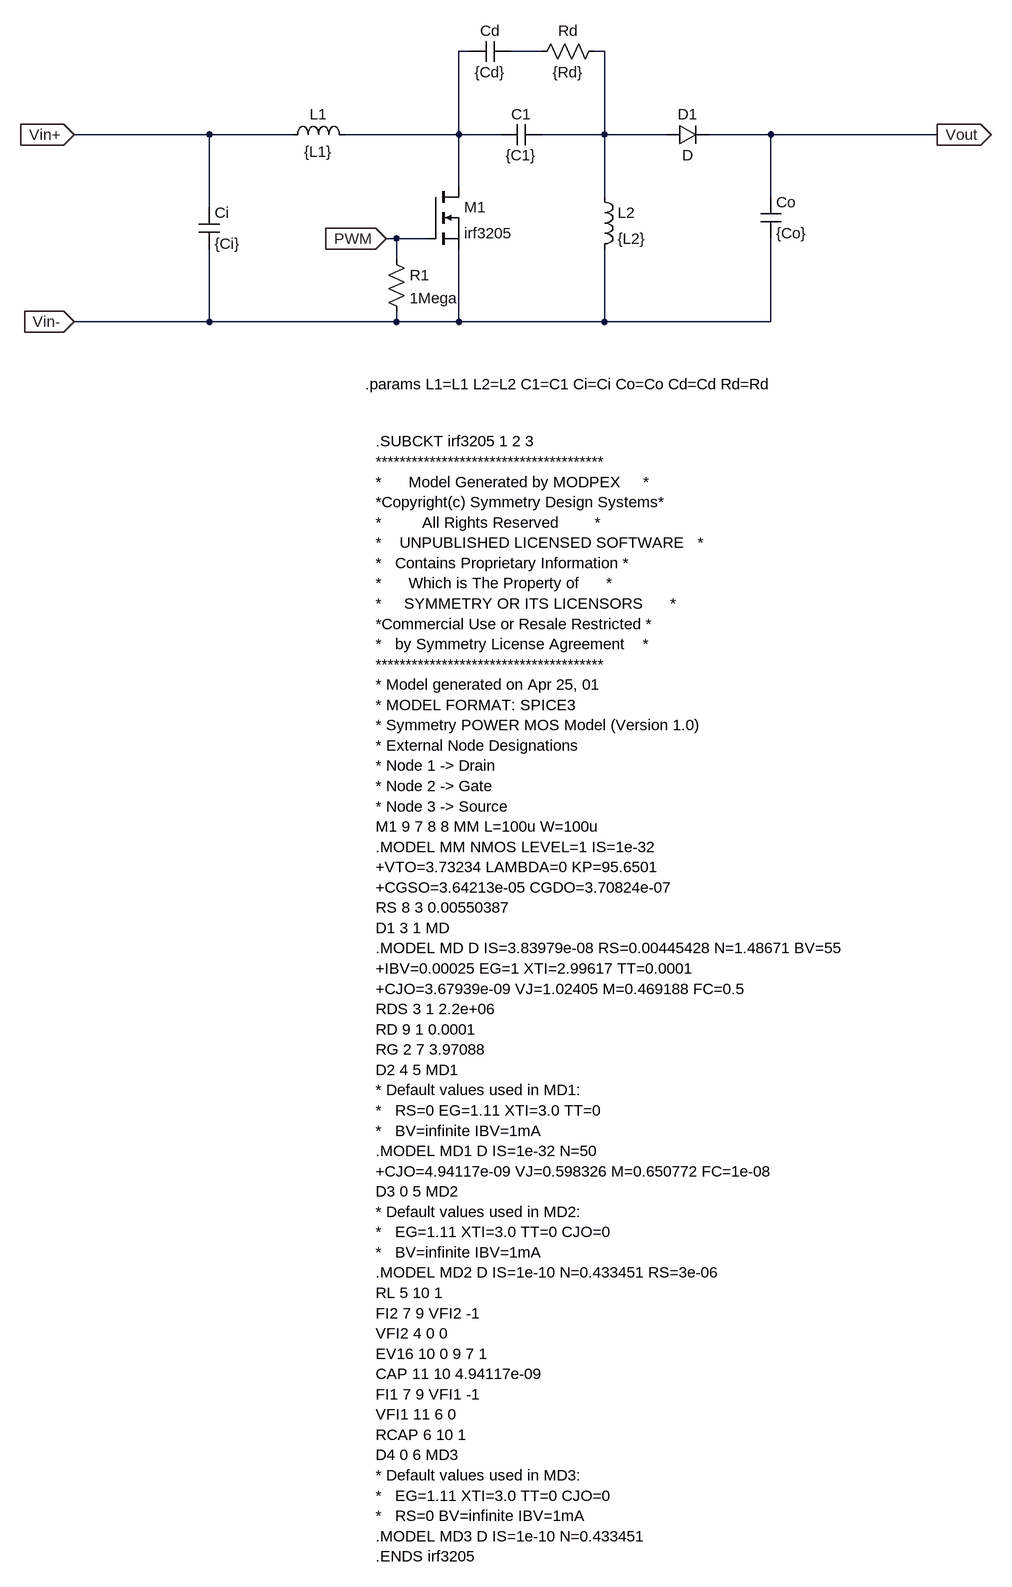
[diagram p0: schematic sepicR2.asc]
sepicR2.asc, the LTspice schematic file:
Version 4
SHEET 1 1704 2092
WIRE 240 -64 224 -64
WIRE 352 -64 304 -64
WIRE 448 -64 432 -64
WIRE -160 64 -368 64
WIRE -32 64 -160 64
WIRE 224 64 224 -64
WIRE 224 64 48 64
WIRE 288 64 224 64
WIRE 448 64 448 -64
WIRE 448 64 352 64
WIRE 544 64 448 64
WIRE 704 64 608 64
WIRE 960 64 704 64
WIRE 224 144 224 64
WIRE 448 160 448 64
WIRE 704 160 704 64
WIRE -160 176 -160 64
WIRE 128 224 112 224
WIRE 176 224 128 224
WIRE 128 256 128 224
WIRE -160 352 -160 240
WIRE -160 352 -368 352
WIRE 128 352 128 336
WIRE 128 352 -160 352
WIRE 224 352 224 240
WIRE 224 352 128 352
WIRE 448 352 448 240
WIRE 448 352 224 352
WIRE 704 352 704 224
WIRE 704 352 448 352
FLAG -368 64 Vin+
IOPIN -368 64 In
FLAG 112 224 PWM
IOPIN 112 224 In
FLAG 960 64 Vout
IOPIN 960 64 Out
FLAG -368 352 Vin-
IOPIN -368 352 In
SYMBOL cap -176 176 R0
SYMATTR InstName Ci
SYMATTR Value {Ci}
SYMBOL ind 432 144 R0
SYMATTR InstName L2
SYMATTR Value {L2}
SYMBOL cap 688 160 R0
SYMATTR InstName Co
SYMATTR Value {Co}
SYMBOL diode 544 80 R270
WINDOW 0 32 32 VTop 2
WINDOW 3 0 32 VBottom 2
SYMATTR InstName D1
SYMBOL ind -48 80 R270
WINDOW 0 32 56 VTop 2
WINDOW 3 5 56 VBottom 2
SYMATTR InstName L1
SYMATTR Value {L1}
SYMBOL cap 352 48 R90
WINDOW 0 0 32 VBottom 2
WINDOW 3 32 32 VTop 2
SYMATTR InstName C1
SYMATTR Value {C1}
SYMBOL cap 304 -80 R90
WINDOW 0 0 32 VBottom 2
WINDOW 3 32 32 VTop 2
SYMATTR InstName Cd
SYMATTR Value {Cd}
SYMBOL res 448 -80 R90
WINDOW 0 0 56 VBottom 2
WINDOW 3 32 56 VTop 2
SYMATTR InstName Rd
SYMATTR Value {Rd}
SYMBOL res 112 240 R0
SYMATTR InstName R1
SYMATTR Value 1Mega
SYMBOL nmos 176 144 R0
SYMATTR InstName M1
SYMATTR Value irf3205
SYMATTR Prefix X
TEXT 80 448 Left 2 !.params L1=L1 L2=L2 C1=C1 Ci=Ci Co=Co Cd=Cd Rd=Rd
TEXT 96 536 Left 2 !.SUBCKT irf3205 1 2 3\n**************************************\n*      Model Generated by MODPEX     *\n*Copyright(c) Symmetry Design Systems*\n*         All Rights Reserved        *\n*    UNPUBLISHED LICENSED SOFTWARE   *\n*   Contains Proprietary Information *\n*      Which is The Property of      *\n*     SYMMETRY OR ITS LICENSORS      *\n*Commercial Use or Resale Restricted *\n*   by Symmetry License Agreement    *\n**************************************\n* Model generated on Apr 25, 01\n* MODEL FORMAT: SPICE3\n* Symmetry POWER MOS Model (Version 1.0)\n* External Node Designations\n* Node 1 -> Drain\n* Node 2 -> Gate\n* Node 3 -> Source\nM1 9 7 8 8 MM L=100u W=100u\n.MODEL MM NMOS LEVEL=1 IS=1e-32\n+VTO=3.73234 LAMBDA=0 KP=95.6501\n+CGSO=3.64213e-05 CGDO=3.70824e-07\nRS 8 3 0.00550387\nD1 3 1 MD\n.MODEL MD D IS=3.83979e-08 RS=0.00445428 N=1.48671 BV=55\n+IBV=0.00025 EG=1 XTI=2.99617 TT=0.0001\n+CJO=3.67939e-09 VJ=1.02405 M=0.469188 FC=0.5\nRDS 3 1 2.2e+06\nRD 9 1 0.0001\nRG 2 7 3.97088\nD2 4 5 MD1\n* Default values used in MD1:\n*   RS=0 EG=1.11 XTI=3.0 TT=0\n*   BV=infinite IBV=1mA\n.MODEL MD1 D IS=1e-32 N=50\n+CJO=4.94117e-09 VJ=0.598326 M=0.650772 FC=1e-08\nD3 0 5 MD2\n* Default values used in MD2:\n*   EG=1.11 XTI=3.0 TT=0 CJO=0\n*   BV=infinite IBV=1mA\n.MODEL MD2 D IS=1e-10 N=0.433451 RS=3e-06\nRL 5 10 1\nFI2 7 9 VFI2 -1\nVFI2 4 0 0\nEV16 10 0 9 7 1\nCAP 11 10 4.94117e-09\nFI1 7 9 VFI1 -1\nVFI1 11 6 0\nRCAP 6 10 1\nD4 0 6 MD3\n* Default values used in MD3:\n*   EG=1.11 XTI=3.0 TT=0 CJO=0\n*   RS=0 BV=infinite IBV=1mA\n.MODEL MD3 D IS=1e-10 N=0.433451\n.ENDS irf3205

The netlist it stands for:
* sepicR2.asc
Ci Vin+ Vin- {Ci}
L2 N003 Vin- {L2}
Co Vout Vin- {Co}
D1 N003 Vout D
L1 Vin+ N001 {L1}
C1 N003 N001 {C1}
Cd N002 N001 {Cd}
Rd N003 N002 {Rd}
R1 PWM Vin- 1Mega
XM1 N001 PWM Vin- irf3205  ; pins D G S
.model D D
.lib standard.dio
.params L1=L1 L2=L2 C1=C1 Ci=Ci Co=Co Cd=Cd Rd=Rd
.SUBCKT irf3205 1 2 3
**************************************
*      Model Generated by MODPEX     *
*Copyright(c) Symmetry Design Systems*
*         All Rights Reserved        *
*    UNPUBLISHED LICENSED SOFTWARE   *
*   Contains Proprietary Information *
*      Which is The Property of      *
*     SYMMETRY OR ITS LICENSORS      *
*Commercial Use or Resale Restricted *
*   by Symmetry License Agreement    *
**************************************
* Model generated on Apr 25, 01
* MODEL FORMAT: SPICE3
* Symmetry POWER MOS Model (Version 1.0)
* External Node Designations
* Node 1 -> Drain
* Node 2 -> Gate
* Node 3 -> Source
M1 9 7 8 8 MM L=100u W=100u
.MODEL MM NMOS LEVEL=1 IS=1e-32
+VTO=3.73234 LAMBDA=0 KP=95.6501
+CGSO=3.64213e-05 CGDO=3.70824e-07
RS 8 3 0.00550387
D1 3 1 MD
.MODEL MD D IS=3.83979e-08 RS=0.00445428 N=1.48671 BV=55
+IBV=0.00025 EG=1 XTI=2.99617 TT=0.0001
+CJO=3.67939e-09 VJ=1.02405 M=0.469188 FC=0.5
RDS 3 1 2.2e+06
RD 9 1 0.0001
RG 2 7 3.97088
D2 4 5 MD1
* Default values used in MD1:
*   RS=0 EG=1.11 XTI=3.0 TT=0
*   BV=infinite IBV=1mA
.MODEL MD1 D IS=1e-32 N=50
+CJO=4.94117e-09 VJ=0.598326 M=0.650772 FC=1e-08
D3 0 5 MD2
* Default values used in MD2:
*   EG=1.11 XTI=3.0 TT=0 CJO=0
*   BV=infinite IBV=1mA
.MODEL MD2 D IS=1e-10 N=0.433451 RS=3e-06
RL 5 10 1
FI2 7 9 VFI2 -1
VFI2 4 0 0
EV16 10 0 9 7 1
CAP 11 10 4.94117e-09
FI1 7 9 VFI1 -1
VFI1 11 6 0
RCAP 6 10 1
D4 0 6 MD3
* Default values used in MD3:
*   EG=1.11 XTI=3.0 TT=0 CJO=0
*   RS=0 BV=infinite IBV=1mA
.MODEL MD3 D IS=1e-10 N=0.433451
.ENDS irf3205
.backanno
.end